# EAGLE design potboard (EAGLE 9.6.1)
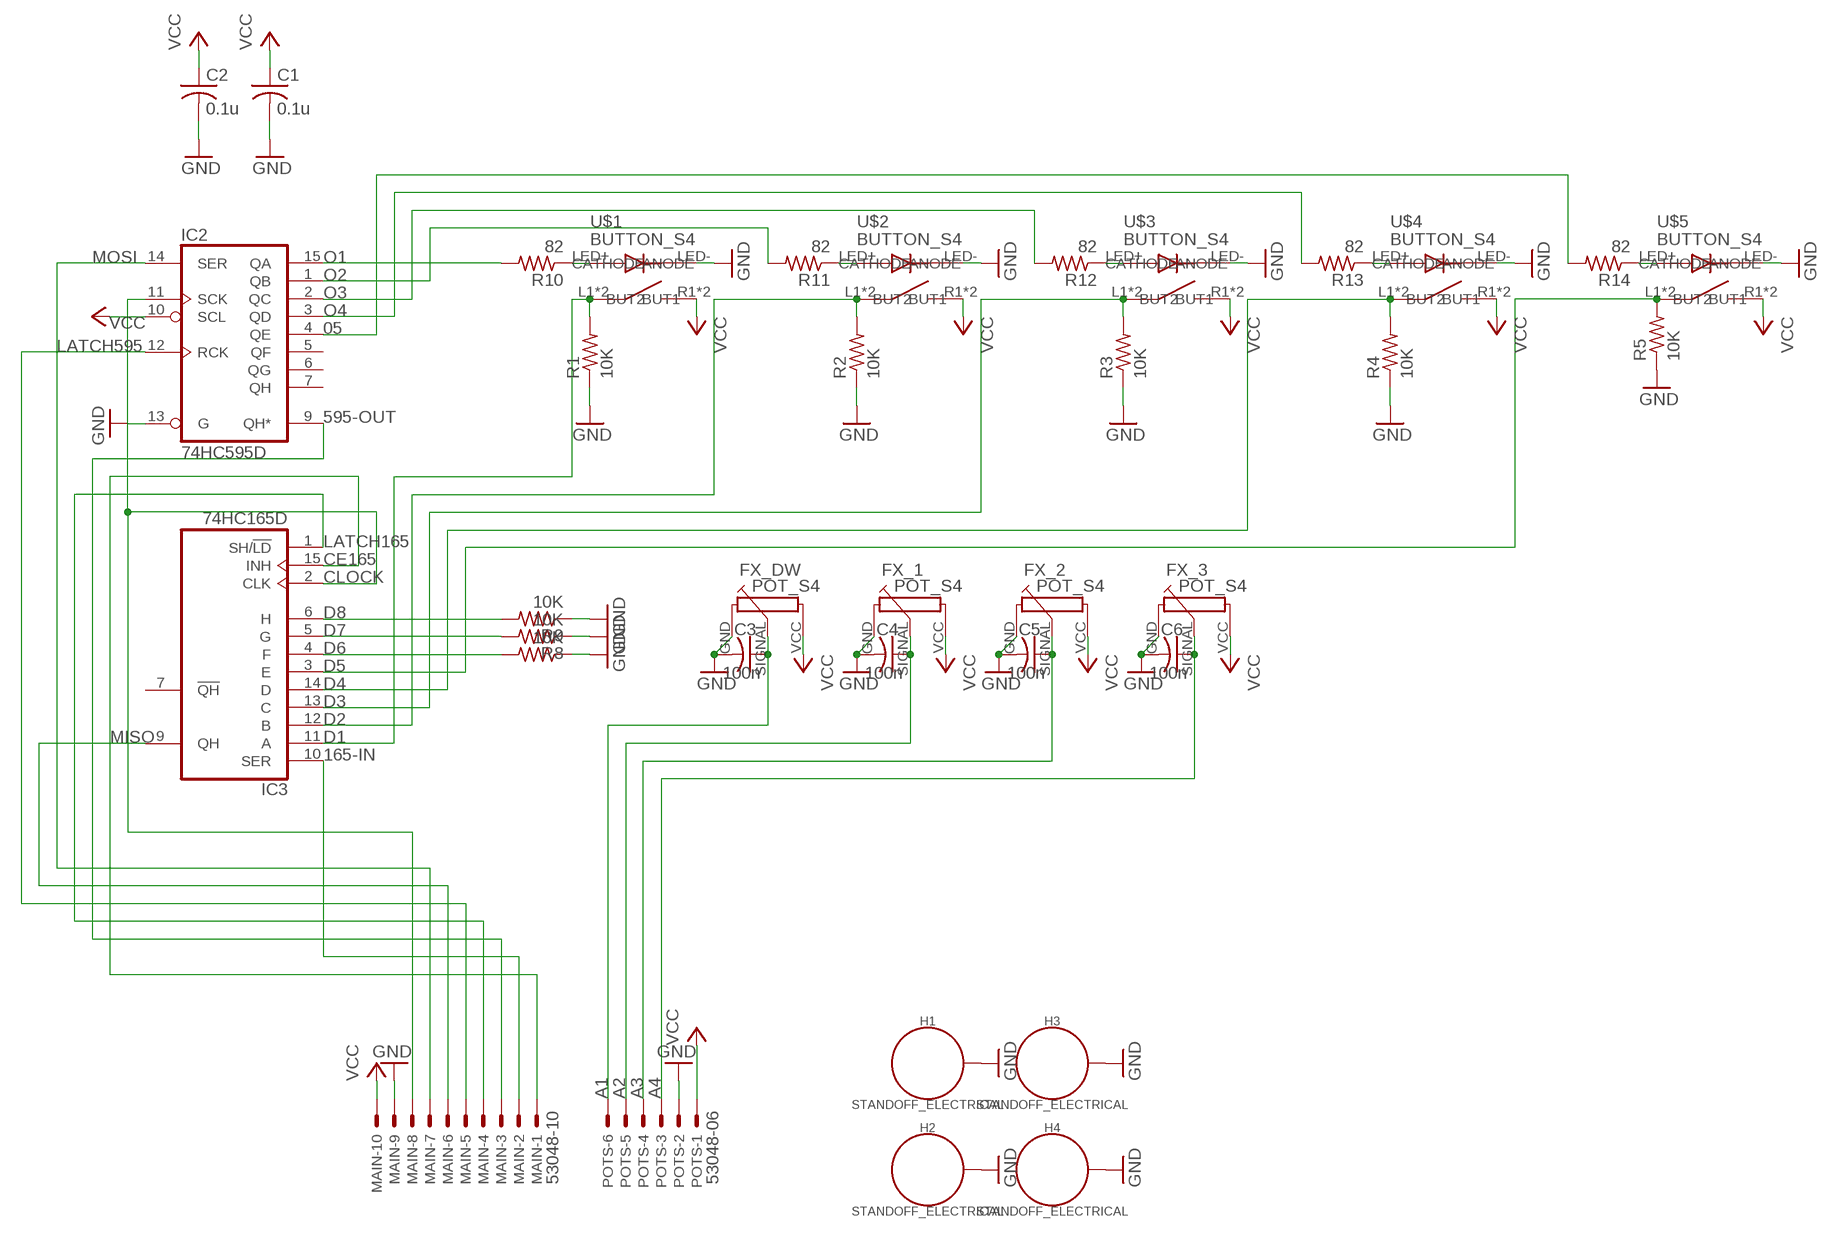
[diagram p0: schematic, sheet 1]

## Parts
C1  0.1u  C-USC1206  [C1206]
C2  0.1u  C-USC1206  [C1206]
C3  100n  C-USC1206  [C1206]
C4  100n  C-USC1206  [C1206]
C5  100n  C-USC1206  [C1206]
C6  100n  C-USC1206  [C1206]
FX_1  POT_S4  [POT_S4]
FX_2  POT_S4  [POT_S4]
FX_3  POT_S4  [POT_S4]
FX_DW  POT_S4  [POT_S4]
H1  STANDOFF_ELECTRICAL  [STANDOFF-ELECTRICAL]
H2  STANDOFF_ELECTRICAL  [STANDOFF-ELECTRICAL]
H3  STANDOFF_ELECTRICAL  [STANDOFF-ELECTRICAL]
H4  STANDOFF_ELECTRICAL  [STANDOFF-ELECTRICAL]
IC2  74HC595D  [SO16]
IC3  74HC165D  [SO16]
MAIN  53048-10  [53048-10]
POTS  53048-06  [53048-06]
R1  10K  R-US_R0805  [R0805]
R2  10K  R-US_R0805  [R0805]
R3  10K  R-US_R0805  [R0805]
R4  10K  R-US_R0805  [R0805]
R5  10K  R-US_R0805  [R0805]
R6  10K  R-US_R0805  [R0805]
R8  10K  R-US_R0805  [R0805]
R9  10K  R-US_R0805  [R0805]
R10  82  R-US_R0805  [R0805]
R11  82  R-US_R0805  [R0805]
R12  82  R-US_R0805  [R0805]
R13  82  R-US_R0805  [R0805]
R14  82  R-US_R0805  [R0805]
U$1  BUTTON_S4  [BUTTON_S4]
U$2  BUTTON_S4  [BUTTON_S4]
U$3  BUTTON_S4  [BUTTON_S4]
U$4  BUTTON_S4  [BUTTON_S4]
U$5  BUTTON_S4  [BUTTON_S4]

## Nets
05: IC2.4(QE) R14.2
165-IN: IC3.10(SER) MAIN.2
595-OUT: IC2.9(QH*) MAIN.3
A1: C3.1 FX_DW.SIGNAL(1S) POTS.6
A2: C4.1 FX_1.SIGNAL(1S) POTS.5
A3: C5.1 FX_2.SIGNAL(1S) POTS.4
A4: C6.1 FX_3.SIGNAL(1S) POTS.3
CE165: IC3.15(INH) MAIN.1
CLOCK: IC2.11(SCK) IC3.2(CLK) MAIN.8
D1: IC3.11(A) R1.2 U$1.L1(BUT1) U$1.L2(BUT1)
D2: IC3.12(B) R2.2 U$2.L1(BUT1) U$2.L2(BUT1)
D3: IC3.13(C) R3.2 U$3.L1(BUT1) U$3.L2(BUT1)
D4: IC3.14(D) R4.2 U$4.L1(BUT1) U$4.L2(BUT1)
D5: IC3.3(E) R5.2 U$5.L1(BUT1) U$5.L2(BUT1)
D6: IC3.4(F) R6.2
D7: IC3.5(G) R8.2
D8: IC3.6(H) R9.2
GND: C1.2 C2.2 C3.2 C4.2 C5.2 C6.2 FX_1.GND(1A) FX_2.GND(1A) FX_3.GND(1A) FX_DW.GND(1A) H1.P1 H2.P1 H3.P1 H4.P1 IC2.13(G) MAIN.9 POTS.2 R1.1 R2.1 R3.1 R4.1 R5.1 R6.1 R8.1 R9.1 U$1.LED-(CATHODE) U$2.LED-(CATHODE) U$3.LED-(CATHODE) U$4.LED-(CATHODE) U$5.LED-(CATHODE)
LATCH165: IC3.1(SH/!LD) MAIN.4
LATCH595: IC2.12(RCK) MAIN.5
MISO: IC3.9(QH) MAIN.6
MOSI: IC2.14(SER) MAIN.7
N$13: R10.1 U$1.LED+(ANODE)
N$21: R11.1 U$2.LED+(ANODE)
N$22: R12.1 U$3.LED+(ANODE)
N$23: R13.1 U$4.LED+(ANODE)
N$24: R14.1 U$5.LED+(ANODE)
O1: IC2.15(QA) R10.2
O2: IC2.1(QB) R11.2
O3: IC2.2(QC) R12.2
O4: IC2.3(QD) R13.2
VCC [power]: C1.1 C2.1 FX_1.VCC(1E) FX_2.VCC(1E) FX_3.VCC(1E) FX_DW.VCC(1E) IC2.10(SCL) MAIN.10 POTS.1 U$1.R1(BUT2) U$1.R2(BUT2) U$2.R1(BUT2) U$2.R2(BUT2) U$3.R1(BUT2) U$3.R2(BUT2) U$4.R1(BUT2) U$4.R2(BUT2) U$5.R1(BUT2) U$5.R2(BUT2)
Unconnected: IC2.5(QF) IC2.6(QG) IC2.7(QH) IC3.7(!QH)

## Power pins joined to a net without a drawn wire
GND: IC2.8(GND) IC3.8(GND)
VCC: IC2.16(VCC) IC3.16(VCC)

## Library data of the parts
C1-C6 = adafruit:C-US: CAPACITOR, American symbol
FX_1-FX_3 FX_DW = S4:POT_S4
H1-H4 = SparkFun-Hardware:STANDOFF_ELECTRICAL: Stand Off Drill holes with an electrical connection. For example, use these to ground your board to a chassis. Example SparkFun Products Screw - Phillips Head (1/4", 4-40, 10 pack) <https://www.sparkfun.com/products/10453> (PRT-10453) Screw - Phillips Head (1/2", 4-40, 10 pack) <https://www.sparkfun.com/products/10452> (PRT-10452) Screw - Phillips Head (3/4", 4-40, 10 pack) <https://www.sparkfun.com/products/10451> (PRT-10451) Screw - Phillips Head (1", 4-40, 10 pack) <https://www.sparkfun.com/products/10450> (PRT-10450)
IC2 = 74xx-eu:74*595: 8-bit SHIFT REGISTER, output latch
IC3 = 74xx-eu:74*165: 8-bit parallel load SHIFT REGISTER
MAIN = con-molex:53?-10: CONNECTOR wire to board 1.25 mm (.049 inch) pitch header; MF: MOLEX; MPN: 53048-1010; OC_FARNELL: 9733108; OC_NEWARK: 98K9838
POTS = con-molex:53?-06: CONNECTOR wire to board 1.25 mm (.049 inch) pitch header; MF: WALDOM/MOLEX; MPN: 53048-0610; OC_FARNELL: 1012260; OC_NEWARK: 38C9911
R1-R6 R8-R14 = rcl:R-US_: RESISTOR, American symbol; SPICEPREFIX: R
U$1-U$5 = S4:BUTTON_S4

## Net classes
0 default: width 0.152 mm
1 power: width 0.102 mm

## Board
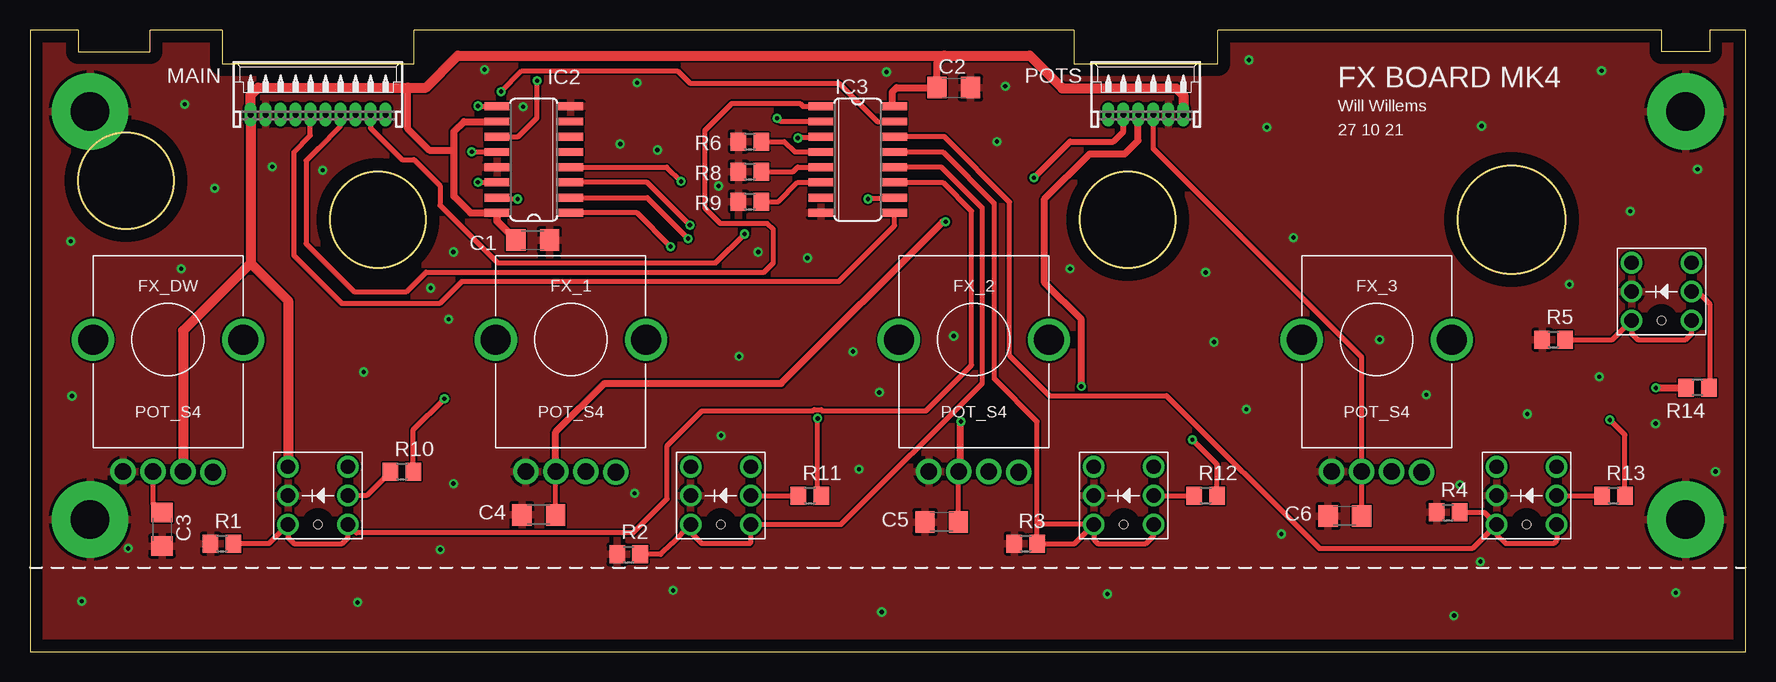
[diagram p1: board, top side]
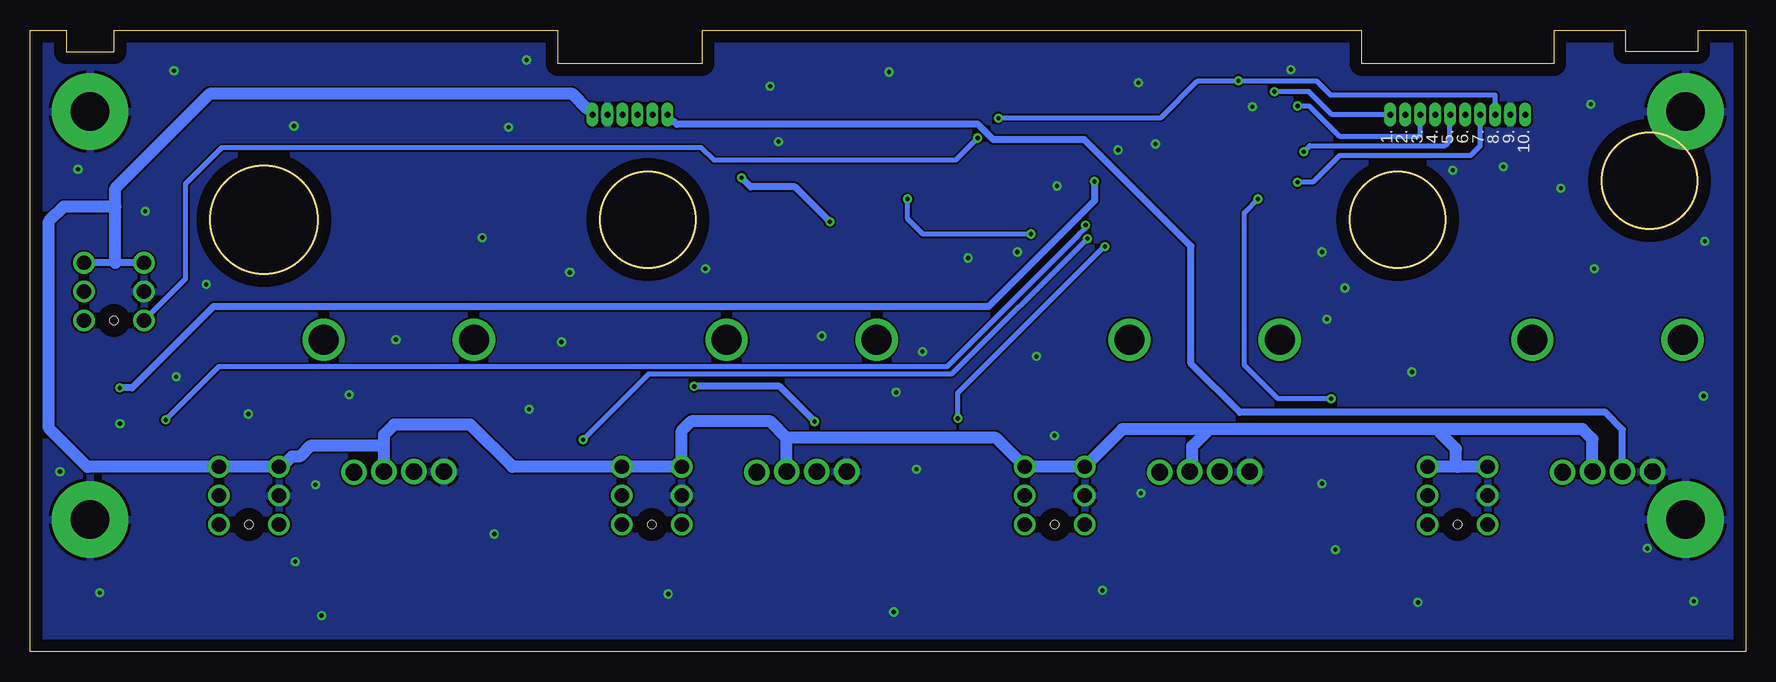
[diagram p2: board, bottom side, seen from below]

Size 143 x 51.8 mm. Coordinates in mm from the lower left corner, seen from the top.
Outline: 0,0 143,0 143,51.8 140,51.8 140,50 136,50 136,51.8 99,51.8 99,49 87,49 87,51.8 32,51.8 32,49 16,49 16,51.8 10,51.8 10,50 4,50 4,51.8 0,51.8 0,0
Outline: circle at 123.5,36 radius 4.5
Outline: circle at 91.5,36 radius 4
Outline: circle at 29,36 radius 4
Outline: circle at 8,39.25 radius 4
Copper layers (1*16): Top 0.035mm / dielectric 1.5mm / Bottom 0.035mm
Design rules "default": minimum track width 6mil, minimum drill 0.35mm, track to track 6mil, track to pad 6mil, pad to pad 6mil, via to via 6mil, smd to smd 6mil, copper to edge 40mil, drill to drill 6mil, minimum pad ring 10mil, minimum via ring 8mil, stop-mask expansion 4mil, vias tented up to drill 0mil, thermal gap 10mil

### Footprints (pad centres in the part's own frame; a part is rotated, then mirrored left to right if it is on the bottom)
C1206 = smd 1.6 x 1.8: 1 -1.4,0; 2 1.4,0
POT_S4 = drill 1.4: DUMMY 3.75,-11.05; GND -3.75,-11; SIGNAL -1.25,-11; VCC 1.25,-11 | drill 2.5: MOUNT-L -6.25,0; MOUNT-R 6.26,0
STANDOFF-ELECTRICAL = drill 3.2 pad 6.35: P1 0,0
SO16 = smd 0.66 x 2.032: 1 -4.445,-3.073; 2 -3.175,-3.073; 3 -1.905,-3.073; 4 -0.635,-3.073; 5 0.635,-3.073; 6 1.905,-3.073; 7 3.175,-3.073; 8 4.445,-3.073; 9 4.445,3.073; 10 3.175,3.073; 11 1.905,3.073; 12 0.635,3.073; 13 -0.635,3.073; 14 -1.905,3.073; 15 -3.175,3.073; 16 -4.445,3.073
53048-10 = drill 0.5 pad 0.698 long: 1 5.625,-1.25; 2 4.375,-1.25; 3 3.125,-1.25; 4 1.875,-1.25; 5 0.625,-1.25; 6 -0.625,-1.25; 7 -1.875,-1.25; 8 -3.125,-1.25; 9 -4.375,-1.25; 10 -5.625,-1.25
53048-06 = drill 0.5 pad 0.698 long: 1 3.125,-1.25; 2 1.875,-1.25; 3 0.625,-1.25; 4 -0.625,-1.25; 5 -1.875,-1.25; 6 -3.125,-1.25
R0805 = smd 1.3 x 1.5: 1 -0.95,0; 2 0.95,0
BUTTON_S4 = drill 1.2: L1 -2.5,-2.4; L2 2.5,-2.4; LED+ 2.5,0; LED- -2.5,0; R1 -2.5,2.4; R2 2.5,2.4 | hole 0.7: 0,-2.4

### Placement (x,y rotation side)
C1  41.9,34.3 0 top
C2  77,47 0 top
C3  11,10.2 270 top
C4  42.4,11.4 180 top
C5  76,10.8 180 top
C6  109.6,11.3 180 top
FX_1  45.08,26 0 top
FX_2  78.67,26 0 top
FX_3  112.25,26 0 top
FX_DW  11.5,26 0 top
H1  5,11 0 top
H2  138,11 0 top
H3  5,45 0 top
H4  138,45 0 top
IC2  42,41 90 top
IC3  69,41 270 top
MAIN  24,46 0 top
POTS  93,46 0 top
R1  16,9 0 top
R2  49.9,8.1 0 top
R3  83,9 0 top
R4  118.2,11.6 0 top
R5  127,26 0 top
R6  60,42.5 0 top
R8  60,40 0 top
R9  60,37.5 0 top
R10  31,15 0 top
R11  65,13 0 top
R12  98,13 0 top
R13  132,13 0 top
R14  139,22 180 top
U$1  24,13 0 top
U$2  57.58,13 0 top
U$3  91.17,13 0 top
U$4  124.75,13 0 top
U$5  136,30 0 top

### Tracks (layer width: path | path; a pad name or v marks a point on that pad's centre or on a via)
05  (via drill 0.35 pad 0.76)
  Top 0.152: R14.2 138.07,22.02 138.04,21.98 | 45.11,40.37 45.11,40.39 IC2.4
  Top 0.406: v54.26,39.18 53.08,40.37 IC2.4
  Top 0.6: R14.2 138.04,21.98 135.52,21.98 v135.51,21.97
  Bottom 0.6: v135.51,21.97 134.49,21.97 127.72,28.75 63.09,28.75 54.26,37.58 v54.26,39.18
165-IN  (via drill 0.35 pad 0.76)
  Top 0.152: 72.01,37.77 72.01,37.8 IC3.10
  Top 0.4: 34.19,37.19 38.99,32.38 57.15,32.38 v59.56,34.8 | IC3.10 72.02,37.77 72.01,37.77 69.9,37.77 v69.85,37.72
  Top 0.406: MAIN.2 28.38,43.62 31,41 32,41 34.19,38.81 34.19,37.19
  Bottom 0.4: v69.85,37.72 69.85,36.07 68.58,34.8 v59.56,34.8
595-OUT  (via drill 0.35 pad 0.76)
  Top 0.152: 38.86,45.45 38.86,45.49 IC2.9
  Top 0.4: IC2.9 38.92,45.45 38.86,45.45 37.35,45.45 v37.34,45.47
  Bottom 0.152: 27.13,44.81 MAIN.3 27.13,44.81
  Bottom 0.4: v37.34,45.47 36.36,45.47 33.81,42.92 27.31,42.92 27.12,43.11 MAIN.3
A1
  Top 0.406: C3.1 10.25,12.35 FX_DW.SIGNAL
  Bottom 0.152: FX_DW.SIGNAL 10.29,15.01 FX_DW.SIGNAL | 89.92,44.81 POTS.6 89.92,44.81
  Bottom 0.6: POTS.6 89.88,44.36 89.69,44.17 89.29,44.17 89.07,43.94 63.98,43.94 62.71,42.67 55.12,42.67 46.23,33.78 46.23,24 42.16,19.94 11.68,19.94 10.25,18.5 FX_DW.SIGNAL
A2  (via drill 0.35 pad 0.76)
  Top 0.152: FX_1.SIGNAL 43.89,15.01 FX_1.SIGNAL
  Top 0.406: C4.1 43.8,14.97 FX_1.SIGNAL
  Top 0.508: v83.69,39.5 86.7,42.5 90.3,42.5 91.12,43.33 POTS.5
  Top 0.6: v76.33,35.81 76.3,35.78 76.04,35.78 62.61,22.35 47.88,22.35 43.83,18.31 FX_1.SIGNAL
  Bottom 0.6: v83.69,39.5 82.93,38.73 79.25,38.73 v76.33,35.81
A3  (via drill 0.35 pad 0.76)
  Top 0.152: 77.57,15.15 FX_2.SIGNAL | 92.35,44.81 POTS.4 92.35,44.81
  Top 0.406: C5.1 77.4,14.98 FX_2.SIGNAL
  Top 0.6: FX_2.SIGNAL 77.57,15.15 77.57,19.15 v77.6,19.18 | v87.63,22.1 87.63,27.69 84.58,30.73 84.58,37.72 88.35,41.48 91.27,41.48 92.38,42.59 POTS.4
  Bottom 0.6: v87.63,22.1 80.52,22.1 v77.6,19.18
A4
  Top 0.152: POTS.3 93.65,44.81 93.62,44.8 | FX_3.SIGNAL 111.02,15.01 FX_3.SIGNAL
  Top 0.4: FX_3.SIGNAL 111,24.51 93.62,41.88 93.62,44.8
  Top 0.406: C6.1 FX_3.SIGNAL
CE165  (via drill 0.35 pad 0.76)
  Top 0.152: IC3.15 72.08,44.2 IC3.15
  Top 0.4: 55,47.37 67.44,47.37 70.63,44.17 IC3.15
  Top 0.406: v39.27,46.67 41,48.4 53.97,48.4 55,47.37
  Bottom 0.152: 29.64,44.75 29.64,44.73 MAIN.1
  Bottom 0.4: v39.27,46.67 36.38,46.67 34.46,44.75 29.64,44.75 MAIN.1
CLOCK  (via drill 0.35 pad 0.76)
  Top 0.152: IC3.2 65.91,44.2 65.8,44.3
  Top 0.4: 65.8,44.3 IC3.2
  Top 0.406: IC2.11 40.7,42.91 42.27,44.47 v42.27,47.57 | IC3.2 62.56,44.17 v62.28,44.46
  Bottom 0.152: 20.88,44.81 MAIN.8
  Bottom 0.4: v62.28,44.46 62.24,44.5 48.74,44.5 45.67,47.57 v42.27,47.57 35.77,47.57 34.59,46.39 20.88,46.39 20.88,44.81 MAIN.8
D1
  Top 0.152: IC3.11 72.08,39.09 | 26.52,10.6 26.52,10.59 U$1.L2
  Top 0.4: IC3.11 72.08,39.09 76.09,39.09 78.49,36.7 78.49,23.88 74.68,20.07 66.06,20.07 65.96,20.16 65.36,20.16 65.26,20.07 56.01,20.07 53.12,17.17 53.12,12.73 50.29,9.9 27.2,9.9 U$1.L2 26.52,10.6
  Top 0.406: R1.2 19.9,9 U$1.L1 21.5,9.5 22,9 26,9 26.5,9.5 U$1.L2
  Bottom 0.152: U$1.L1 21.49,10.59 U$1.L1 | 26.47,10.57 26.44,10.59 U$1.L2
  Bottom 0.4: U$1.L1 | 26.47,10.57 U$1.L2
D2
  Top 0.152: IC3.12 72.08,40.39 72.09,40.39 | 60.12,10.6 60.12,10.59 U$2.L2 | 55.09,10.59 U$2.L1 55.09,10.59
  Top 0.4: IC3.12 72.09,40.39 75.95,40.39 79.38,36.96 79.38,22.35 67.62,10.6 60.12,10.6 U$2.L2 | U$2.L1 53.48,9
  Top 0.406: U$2.L2 60.08,9.08 60,9 56,9 55.09,9.91 55.09,10.59 | 53.48,9 52.58,8.1 R2.2
  Bottom 0.152: U$2.L2 60.12,10.59 U$2.L2
  Bottom 0.4: U$2.L2
D3
  Top 0.152: R3.2 83.97,8.99 83.97,9 | 88.64,10.57 88.62,10.59 U$3.L1 | IC3.13 72.08,41.68 72.08,41.63
  Top 0.4: IC3.13 72.08,41.63 76.09,41.63 80.39,37.34 80.39,22.73 83.95,19.17 83.95,11 R3.2 83.97,9 87.07,9 88.64,10.57 U$3.L1
  Top 0.406: U$3.L2 93.67,9.67 93,9 89,9 88.67,9.33 U$3.L1 84.35,10.6 83.95,11
  Bottom 0.152: 88.69,10.58 88.7,10.59 U$3.L1
  Bottom 0.4: U$3.L1 88.69,10.58
D4
  Top 0.152: 119.18,11.67 R4.2 | IC3.14 72.08,42.9 72.09,42.93 | U$4.L1
  Top 0.4: IC3.14 72.09,42.93 76.2,42.93 81.66,37.47 81.66,24.64 84.96,21.34 94.74,21.34 107.5,8.57 116.25,8.57 | U$4.L1
  Top 0.406: U$4.L1 120.22,8.57 116.25,8.57 | R4.2 121.25,11.6 U$4.L1 | U$4.L2 127.25,9.25 127,9 123,9 122.25,9.75 U$4.L1
  Bottom 0.152: 122.28,10.57 122.3,10.59 U$4.L1
  Bottom 0.4: U$4.L1 122.28,10.57
D5  (via drill 0.35 pad 0.76)
  Top 0.152: IC3.3 65.91,42.9 65.87,42.85 | 133.48,27.58 133.5,27.58 U$5.L1 | 127.94,26.06 R5.2 127.94,26.06
  Top 0.4: v64.01,42.8 64.06,42.85 65.87,42.85 IC3.3 | R5.2 131.9,26 133.48,27.58 133.5,27.58 U$5.L1
  Top 0.406: U$5.L1 133.5,26.5 134,26 138,26 138.5,26.5 U$5.L2
  Bottom 0.152: 133.43,27.67 133.43,27.66 U$5.L1
  Bottom 0.4: 86,40.95 65.85,40.95 v64.01,42.8 | 87.05,42 121.05,42 | 130.03,39 130.03,31.07 133.43,27.67 U$5.L1
  Bottom 0.406: 86,40.95 87.05,42 | 130.03,39 127.03,42 121.05,42
D6
  Top 0.152: R6.2 60.96,42.52 R6.2 | 65.91,41.63 65.91,41.6 IC3.4
  Top 0.4: R6.2 62.89,42.5 63.75,41.63 65.91,41.63 IC3.4
D7
  Top 0.152: R8.2 | 65.91,40.37 65.91,40.39 IC3.5
  Top 0.4: IC3.5 65.91,40.37 63.99,40.37 63.62,40 R8.2
D8
  Top 0.152: R9.2 | 65.91,39.09 IC3.6
  Top 0.4: IC3.6 65.91,39.09 63.99,39.09 62.39,37.5 R9.2
GND  (via drill 0.35)
  other vias: 50.6,47.4 52.3,41.8 49.2,42.3 35.3,33.3 20.2,40.4 12.9,45.6 15.4,38.6 12.6,31.9 3.4,34.2 3.5,21.3 8.2,8.6 4.3,4.2 27.3,4.1 34.2,8.5 35.3,14 50.4,13.2 53.6,5.1 71,3.3 89.8,4.8 118.7,3 137.2,4.9 120.9,7.5 119.2,13.9 124.8,19.8 130.8,22.9 135.5,19 128.3,30.6 133.4,36.7 139,40.2 131,48.4 121,43.8 103.1,43.7 101.6,49.3 105.3,34.5 98,31.6 98.7,25.8 101.4,20.2 116.4,21.4 104.3,9.8 86.7,31.9 80.6,42.5 81.3,47.1 71.4,48.3 68.6,25 59.1,24.6 34.9,27.7 27.8,23.3 57.6,18 64.8,32.8 33.4,30.3 60.7,33.3 57.4,38.8 69.1,15.2 24.4,40.1 37.9,48.5 41.1,45.4 77,26.3 70.8,21.6 112.5,26 140.5,15
  pour Bottom: 0,0 143,0 143,52 0,52
  pour Top: 0,0 143,0 143,52 0,52
LATCH165
  Top 0.152: 65.91,45.45 65.91,45.41 IC3.1 | 25.91,44.81 MAIN.4 25.91,44.81
  Top 0.4: 33,31.62 61.2,31.62 61.96,32.38 61.96,35.18 61.45,35.69 57.53,35.69 56.26,36.96 56.26,43.43 58.52,45.69 64.18,45.69 64.43,45.45 65.91,45.45 IC3.1 65.91,45.47 | MAIN.4 25.88,43.78 24,41.91
  Top 0.406: 24,41.91 23,40.91 23,34 27,30 31.38,30 33,31.62
LATCH595  (via drill 0.35 pad 0.76)
  Top 0.152: 38.86,41.65 38.86,41.68 IC2.12
  Top 0.4: IC2.12 38.92,41.65 38.86,41.65 36.84,41.65 v36.83,41.66
  Bottom 0.152: 24.61,44.81 MAIN.5 24.61,44.81
  Bottom 0.4: v36.83,41.66 36.33,42.16 25.03,42.16 24.62,42.56 MAIN.5
MISO
  Top 0.152: 72.07,36.5 72.08,36.5 IC3.9 | 23.39,44.81 MAIN.6 23.39,44.81
  Top 0.4: 36,30.86 67.44,30.86 72.07,35.5 72.07,36.5 IC3.9 | 23.38,43 MAIN.6
  Top 0.406: 36,30.86 34.14,29 26,29 22,33 22,41.62 23.38,43
MOSI  (via drill 0.35 pad 0.76)
  Top 0.152: 38.86,39.1 38.86,39.09 IC2.14
  Top 0.4: IC2.14 38.92,39.1 38.86,39.1 37.35,39.1 v37.34,39.12
  Bottom 0.152: 22.1,44.81 MAIN.7 22.1,44.81
  Bottom 0.4: v37.34,39.12 36.07,39.12 33.84,41.34 22.92,41.34 22.12,42.14 MAIN.7
N$13
  Top 0.406: R10.1 28.05,13 U$1.LED+
N$21
  Top 0.406: U$2.LED+ R11.1
N$22
  Top 0.406: U$3.LED+ R12.1
N$23
  Top 0.406: U$4.LED+ R13.1
N$24
  Top 0.406: U$5.LED+ 139,30 140,29 140,22.05 R14.1
O1  (via drill 0.35 pad 0.76)
  Top 0.152: R10.2 31.93,15.01 R10.2 | 39.03,37.72 38.94,37.8 IC2.15
  Top 0.4: v34.54,21.08 31.95,18.49 R10.2 | v40.64,37.72 39.03,37.72 IC2.15
  Bottom 0.4: v34.54,21.08 38.99,21.08 41.78,23.88 41.78,36.58 v40.64,37.72
O2  (via drill 0.35 pad 0.76)
  Top 0.152: 65.99,13.03 R11.2 65.99,13.03
  Top 0.4: v53.4,33.76 50.6,36.55 | R11.2 65.66,13.29 v65.66,19.43
  Top 0.406: 50.6,36.55 | 50.6,36.55 IC2.1
  Bottom 0.4: v53.4,33.76 53.49,33.76 65.66,21.59 v65.66,19.43
O3  (via drill 0.35 pad 0.76)
  Top 0.152: R12.2 98.98,13.03 98.95,13.03
  Top 0.4: v54.86,34.42 51.46,37.83 | R12.2 98.95,13.03 98.95,15.6 v96.9,17.65
  Top 0.406: 51.46,37.83 | IC2.2 51.46,37.83
  Bottom 0.4: v54.86,34.42 66.17,23.11 91.44,23.11 v96.9,17.65
O4  (via drill 0.35 pad 0.76)
  Top 0.152: R13.2 132.97,13.03 132.95,13.03
  Top 0.4: v55.01,35.54 51.46,39.09 | R13.2 132.95,13.03 132.95,18.05 v131.7,19.3
  Top 0.406: 51.46,39.09 | 51.46,39.09 IC2.3
  Bottom 0.4: v55.01,35.54 55.01,35.29 55.15,35.15 55.17,35.15 55.59,34.72 55.59,34.7 66.55,23.75 127.25,23.75 v131.7,19.3
VCC
  Top 0.152: C2.1 75.59,47.02 75.6,47.02 | IC3.16 72.08,45.49 71.88,45.49 | 18.36,44.81 MAIN.10 18.36,44.81 | 38.94,36.58 IC2.16 38.94,36.58 | 38.94,44.2 IC2.10 38.94,44.2
  Top 0.6: IC2.10 36.17,44.17 35.35,43.35 35.35,41.78 | 76.2,49.66 75.6,49.06 75.6,47.02 C2.1 72.23,47 71.88,46.65 71.88,45.49 71.88,45.48 71.85,45.45 | 71.78,45.45 71.85,45.45 | 71.85,45.45 IC3.16 | 35.35,41.78 35.35,37.93 36.72,36.55 38.32,36.55 38.35,36.52 38.38,36.55 IC2.16 | 35.35,41.78 33.27,41.78 31.5,43.56 31.5,47
  Top 0.61: C1.1 38.93,35.87 IC2.16
  Top 0.813: 18.38,32.38 MAIN.10 18.38,46.38 19,47 31.5,47 33,47 35.66,49.66 76.2,49.66 83.34,49.66 86.06,46.94 95.56,46.94 96.12,46.38 POTS.1 | FX_DW.VCC 12.75,26.75 18.38,32.38 | 18.38,32.38 21.5,29.25 U$1.R1
  Bottom 0.152: 21.57,15.4 21.57,15.39 U$1.R1 | 12.72,15 12.72,15.01 FX_DW.VCC | U$3.R2 93.73,15.39 93.73,15.4 | U$4.R1 122.3,15.39 122.03,15.4 | U$4.R2 | U$5.R1 133.5,32.38 U$5.R1 | FX_1.VCC 46.12,15.21 | FX_2.VCC 79.93,15.01 FX_2.VCC | FX_3.VCC 113.54,15.01 FX_3.VCC | 55.09,15.39 U$2.R1 55.09,15.39 | 26.52,15.39 U$1.R2 26.52,15.39 | 60.12,15.39 U$2.R2 60.12,15.39 | 88.7,15.39 U$3.R1 88.7,15.39 | 138.53,32.38 U$5.R2 138.53,32.38
  Bottom 0.6: U$5.R2 135.89,32.4 U$5.R1 | POTS.1 96.12,44.82
  Bottom 1: 44.7,18.54 13.59,18.54 12.75,17.7 12.75,15.06 12.69,15 12.72,15 FX_DW.VCC | 44.7,18.54 51.94,18.54 U$2.R1 U$2.R2 62.5,17.81 79.92,17.81 | 135.89,32.4 135.89,37.08 | 135.89,37.08 135.89,38.61 128.02,46.48 97.79,46.48 96.56,45.26 96.13,45.26 96.12,45.25 96.12,44.82 | 135.89,37.08 140.21,37.08 141.43,35.86 141.43,18.62 138.21,15.4 U$4.R2 122.03,15.4 121.18,16.26 120.52,16.26 119.63,17.14 113.5,17.14 | 113.5,17.14 113.5,18.07 112.65,18.92 106.3,18.92 102.78,15.4 93.73,15.4 U$3.R1 88.67,18.39 87.88,19.18 81.28,19.18 79.92,17.81 | FX_3.VCC 113.5,17.14 | 25.4,18.16 24.13,16.89 24.13,15.53 24,15.4 | 44.7,18.54 46.12,17.12 46.12,15.21 FX_1.VCC | U$1.R1 21.57,15.4 24,15.4 | 24,15.4 U$1.R2 | FX_2.VCC 79.92,17.81

### Text on the board
bPlace: 1. / 2. / 3. / 4. / 5. / 6. / 7. / 8. / 9. / 10.
tNames: FX BOARD MK4 | Will Willems | 27 10 21